# EAGLE design Adafruit NeoPixel 8 Stick (EAGLE 6.3)
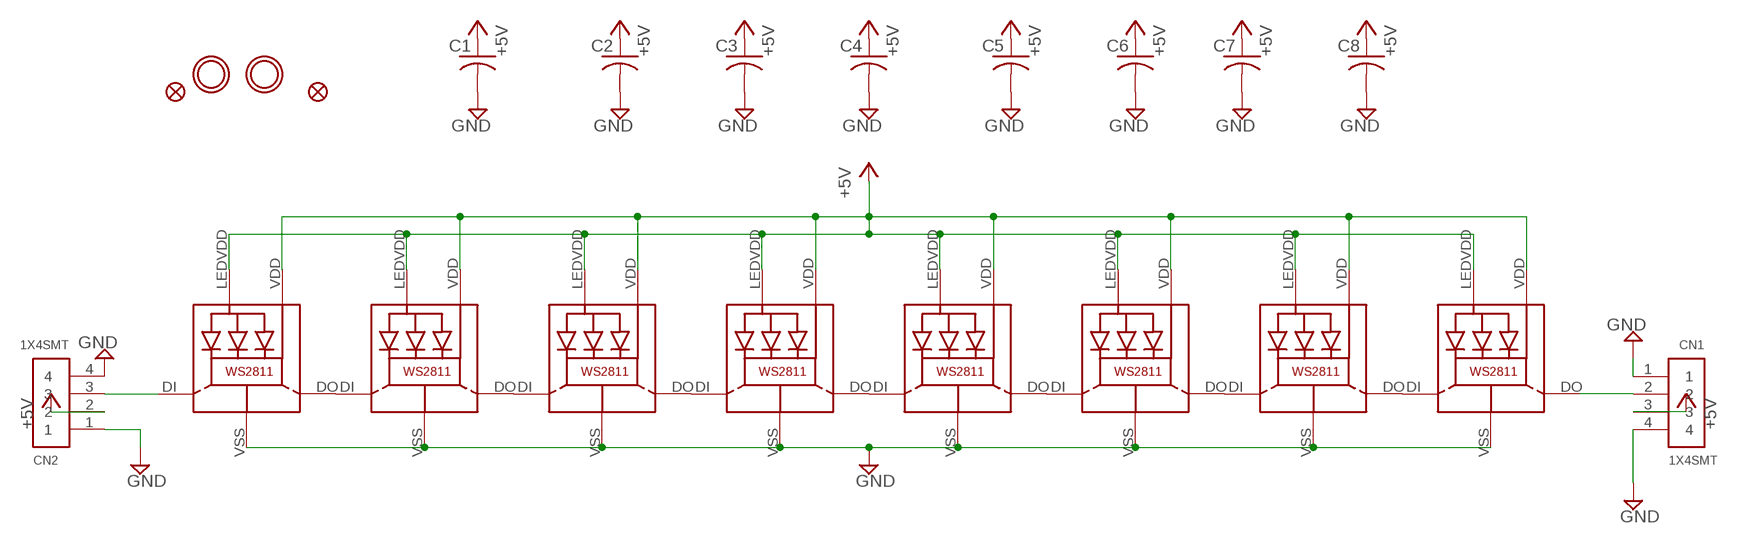
[diagram p0: schematic, sheet 1]

## Parts
C1  C-USC0805K  [C0805K]
C2  C-USC0805K  [C0805K]
C3  C-USC0805K  [C0805K]
C4  C-USC0805K  [C0805K]
C5  C-USC0805K  [C0805K]
C6  C-USC0805K  [C0805K]
C7  C-USC0805K  [C0805K]
C8  C-USC0805K  [C0805K]
CN1  1X4SMT  [1X4-SMT]
CN2  1X4SMT  [1X4-SMT]
FID1  FIDUCIAL""  [FIDUCIAL_1MM]
FID3  FIDUCIAL""  [FIDUCIAL_1MM]
LED1  WS28115050  [WS28115050]
LED2  WS28115050  [WS28115050]
LED3  WS28115050  [WS28115050]
LED4  WS28115050  [WS28115050]
LED5  WS28115050  [WS28115050]
LED6  WS28115050  [WS28115050]
LED7  WS28115050  [WS28115050]
LED8  WS28115050  [WS28115050]
U$2  MOUNTINGHOLE2.0  [MOUNTINGHOLE_2.0_PLATED]
U$3  MOUNTINGHOLE2.0  [MOUNTINGHOLE_2.0_PLATED]

## Nets
+5V: C1.1 C2.1 C3.1 C4.1 C5.1 C6.1 C7.1 C8.1 CN1.3 CN2.2 LED1.LEDVDD LED1.VDD LED2.LEDVDD LED2.VDD LED3.LEDVDD LED3.VDD LED4.LEDVDD LED4.VDD LED5.LEDVDD LED5.VDD LED6.LEDVDD LED6.VDD LED7.LEDVDD LED7.VDD LED8.LEDVDD LED8.VDD
GND: C1.2 C2.2 C3.2 C4.2 C5.2 C6.2 C7.2 C8.2 CN1.1 CN1.4 CN2.1 CN2.4 LED1.VSS(GND) LED2.VSS(GND) LED3.VSS(GND) LED4.VSS(GND) LED5.VSS(GND) LED6.VSS(GND) LED7.VSS(GND) LED8.VSS(GND)
N$1: LED1.DO LED2.DI
N$2: LED2.DO LED3.DI
N$3: LED3.DO LED4.DI
N$4: LED4.DO LED5.DI
N$5: LED5.DO LED6.DI
N$6: LED6.DO LED7.DI
N$7: LED7.DO LED8.DI
N$8: CN2.3 LED1.DI
N$9: CN1.2 LED8.DO

## Library data of the parts
C1-C8 = rcl:C-US: CAPACITOR, American symbol
CN1 CN2 = adafruit:1X4: 4-pin connector
FID1 FID3 = microbuilder:FIDUCIAL: Fiducial Alignment Points Various fiducial points for machine vision alignment.; BOM: EXCLUDE
LED1-LED8 = microbuilder:WS28115050
U$2 U$3 = microbuilder:MOUNTINGHOLE: Mounting Hole For #2 screws (0.086"/2.18mm width, 0.094"/2.4mm hole) use 2.5mm

## Board
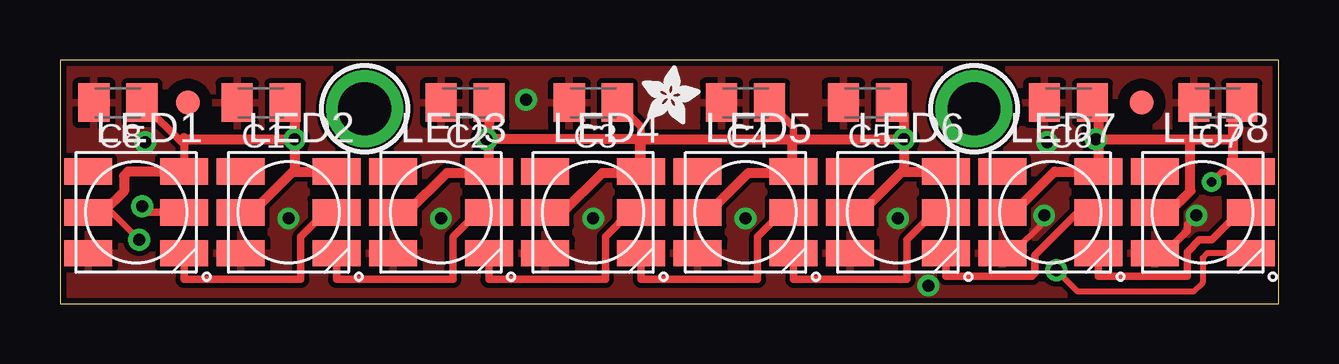
[diagram p1: board, top side]
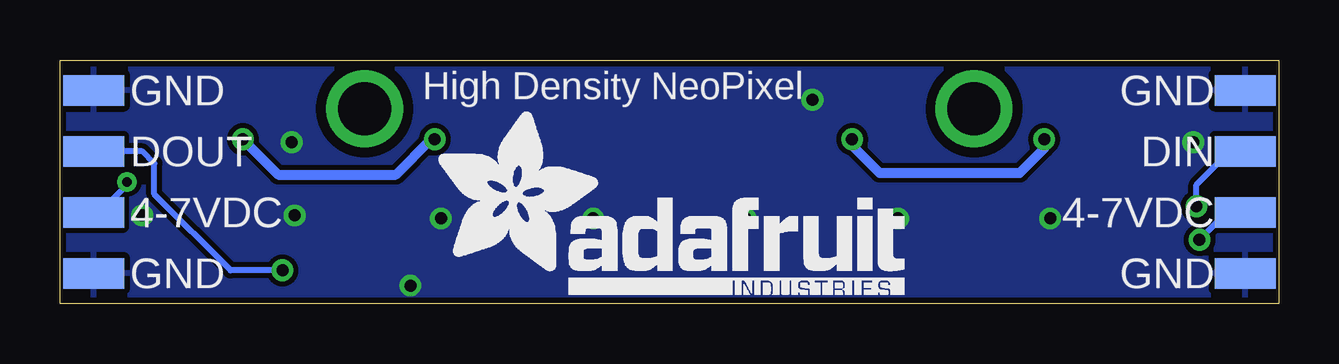
[diagram p2: board, bottom side, seen from below]

Size 50.8 x 10.16 mm. Coordinates in mm from the lower left corner, seen from the top.
Outline: 0,0 50.8,0 50.8,10.16 0,10.16 0,0
Copper layers (1*16): Top 0.035mm / dielectric 1.5mm / Bottom 0.035mm
Design rules "adafruit *": minimum track width 8mil, minimum drill 15.5mil, track to track 8mil, track to pad 8mil, pad to pad 8mil, via to via 8mil, smd to smd 8mil, copper to edge 10mil, drill to drill 8mil, minimum pad ring 10mil, minimum via ring 8mil, stop-mask expansion 4mil, vias tented up to drill 20mil, thermal gap 10mil

### Footprints (pad centres in the part's own frame; a part is rotated, then mirrored left to right if it is on the bottom)
C0805K = smd 1.3 x 1.6: 1 -1,0; 2 1,0
1X4-SMT = smd 1.27 x 2.54: 1 -3.81,0; 2 -1.27,0; 3 1.27,0; 4 3.81,0
FIDUCIAL_1MM = smd 1 x 1: 1 0,0
WS28115050 = smd 2 x 1.1: DI 2,0; DO 2,-1.7; LEDVDD -2,0; NC -2,1.7; VDD 2,1.7; VSS -2,-1.7
MOUNTINGHOLE_2.0_PLATED = drill 2.2 pad 3: P$1 0,0

### Placement (x,y rotation side)
C1  8.38,8.38 180 top
C2  16.89,8.38 180 top
C3  22.23,8.38 180 top
C4  28.57,8.38 180 top
C5  33.66,8.38 180 top
C6  42.04,8.38 180 top
C7  48.26,8.38 180 top
C8  2.41,8.38 180 top
CN1  49.4,5.08 270 bottom
CN2  1.4,5.08 90 bottom
FID1  5.33,8.38 0 top
FID3  45.09,8.38 0 top
LED1  3.17,3.81 0 top
LED2  9.53,3.81 0 top
LED3  15.88,3.81 0 top
LED4  22.23,3.81 0 top
LED5  28.57,3.81 0 top
LED6  34.92,3.81 0 top
LED7  41.27,3.81 0 top
LED8  47.62,3.81 0 top
U$1  [ADAFRUIT_TEXT_20MM]  35.18,0.38 0 bottom
U$2  12.7,8.13 0 top
U$3  38.1,8.13 0 top
U$4  [ADAFRUIT_2.5MM]  24.26,7.49 0 top

### Tracks (layer width: path | path; a pad name or v marks a point on that pad's centre or on a via)
+5V  (via drill 0.4, 0.5)
  Top 0.254: v3.3,2.67 2.16,3.81 1.78,3.81 LED1.LEDVDD | 48.97,5.51 LED8.VDD 48.44,5.51 v48.01,5.08 | 48.9,8.11 48.99,8.11 C7.1
  Top 0.305: LED2.VDD 11.57,5.56 | C3.1 24.23,7.38 24.23,6.86 | C4.1 30.57,7.38 30.57,6.86 LED5.VDD | C8.1 5.19,6.6 5.19,5.51 LED1.VDD 5.17,6.91
  Top 0.406: LED2.LEDVDD 8,3.81 9.7,5.51 9.78,5.51 | 9.78,5.51 LED2.VDD | LED3.LEDVDD 14.48,3.81 16.13,5.46 17.83,5.46 LED3.VDD 17.88,6.86 | LED4.LEDVDD 20.95,3.81 22.61,5.46 24.18,5.46 | 24.18,5.46 LED4.VDD 24.23,6.86 | 24.18,6.86 17.88,6.86 | 24.23,6.86 30.53,6.86 | 43.27,6.86 47.12,6.86 | 47.12,6.86 48.9,6.86 | LED6.LEDVDD 33.4,3.81 35.1,5.51 35.18,5.51 | 35.18,5.51 LED6.VDD | LED5.LEDVDD 27.05,3.81 28.7,5.46 30.53,5.46 | 30.53,5.46 LED5.VDD | LED7.LEDVDD 39.75,3.81 41.45,5.51 LED7.VDD 43.27,6.86 | 24.18,5.46 24.18,6.86 | 24.18,6.86 24.23,6.86 | 30.53,5.46 30.53,6.86 | 30.53,6.86 30.57,6.86 v35.18,6.86 | 48.9,6.86 48.9,5.59 48.97,5.51 | LED8.LEDVDD 46.23,3.81 47.12,4.7 47.12,6.86 | LED1.VDD 2.84,5.51 2.67,5.33 2.67,4.7 1.78,3.81 | C1.1 9.78,7.99 v9.78,6.86 | v9.78,6.86 9.78,5.51 | 5.17,6.91 5.23,6.86 v9.78,6.86 | C2.1 17.88,8.37 17.88,6.86 | C5.1 35.18,7.86 v35.18,6.86 | v35.18,6.86 35.18,5.51 | C6.1 43.27,8.38 43.27,6.86 | 17.88,6.86 v17.78,6.86 | 43.27,6.86 v43.18,6.86 | 48.9,8.11 48.9,6.86
  Bottom 0.254: CN2.2 2.16,3.81 v3.3,2.67 | v48.01,5.08 48.01,4.95 49.15,3.81 CN1.3
  Bottom 0.406: v17.78,6.86 17.78,6.6 16.64,5.46 10.79,5.46 9.78,6.48 v9.78,6.86 | v43.18,6.86 41.7,5.38 36.8,5.38 35.32,6.86 v35.18,6.86
GND  (via drill 0.5)
  Top 0.254: LED7.VSS 39.7,2.11 41.02,3.43 v41.02,3.68
  Top 0.305: LED8.VSS 46.05,2.11 46.99,3.05 46.99,3.3 v47.37,3.68
  other vias: 9.53,3.56 15.88,3.56 22.23,3.56 28.57,3.56 34.92,3.56 19.43,8.51 3.56,6.73 41.15,6.73 36.2,0.76
  pour Top: 0,10.16 0,0 50.93,0 50.93,10.16
  pour Bottom: -0.13,10.29 -0.13,0 50.93,0 50.93,10.29
N$1
  Top 0.305: LED1.DO 5.17,1.02 10.03,1.02 10.03,2.79 11.05,3.81 LED2.DI
N$2
  Top 0.305: LED2.DO 11.53,1.02 16.38,1.02 16.38,2.79 17.4,3.81 LED3.DI
N$3
  Top 0.305: LED3.DO 17.88,1.02 22.73,1.02 22.73,2.79 23.75,3.81 LED4.DI
N$4
  Top 0.305: LED4.DO 24.23,1.02 29.08,1.02 29.08,2.79 30.1,3.81 LED5.DI
N$5
  Top 0.305: LED5.DO 30.57,1.02 35.31,1.02 35.31,2.67 36.45,3.81 LED6.DI
N$6
  Top 0.305: LED6.DO 36.92,1.14 40.51,1.14 40.64,1.27 40.64,2.03 42.42,3.81 LED7.DI
N$7
  Top 0.305: LED7.DO 43.27,1.14 46.99,1.14 46.99,2.16 47.5,2.67 48.01,2.67 49.15,3.81 LED8.DI
N$8  (via drill 0.5)
  Top 0.305: v3.43,4.06 3.68,3.81 LED1.DI
  Bottom 0.254: v3.43,4.06 3.43,4.95 2.03,6.35 CN2.3
N$9  (via drill 0.5)
  Top 0.254: 49.66,2.08 49.36,1.78 | LED8.DO 47.83,2.11 47.62,1.91 47.62,0.89 47.24,0.51 42.42,0.51 v41.53,1.4
  Top 0.406: LED8.DO 49.66,2.08
  Bottom 0.254: v41.53,1.4 43.69,1.4 46.86,4.57 46.86,5.84 47.37,6.35 CN1.2

### Text on the board
bPlace: GND | High Density NeoPixel | GND | DIN | DOUT | 4-7VDC | 4-7VDC | GND | GND